# Altium schematic sheet Schematic-Indheater (Altium).schdoc
size 252 x 108 mm
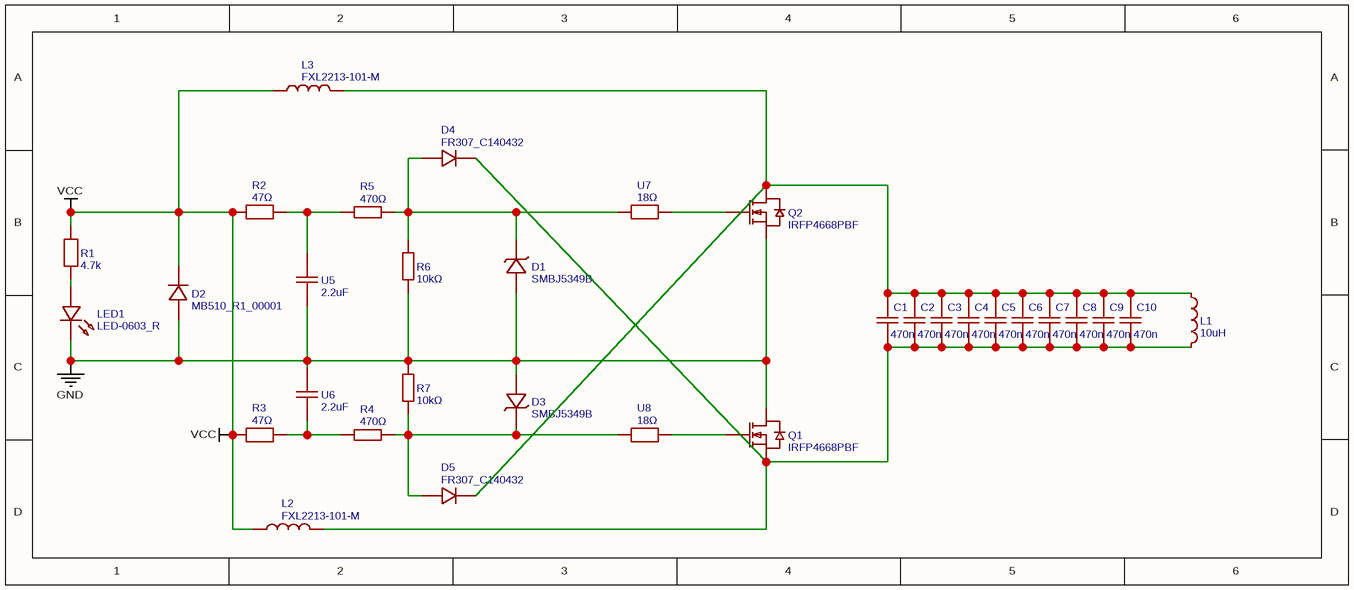
[diagram p0: Schematic-Indheater (Altium).schdoc]

## Parts
C1  470n  [CAP-TH_L17.8-W9.2-P15.00-D0.8]
C2  470n  [CAP-TH_L17.8-W9.2-P15.00-D0.8]
C3  470n  [CAP-TH_L17.8-W9.2-P15.00-D0.8]
C4  470n  [CAP-TH_L17.8-W9.2-P15.00-D0.8]
C5  470n  [CAP-TH_L17.8-W9.2-P15.00-D0.8]
C6  470n  [CAP-TH_L17.8-W9.2-P15.00-D0.8]
C7  470n  [CAP-TH_L17.8-W9.2-P15.00-D0.8]
C8  470n  [CAP-TH_L17.8-W9.2-P15.00-D0.8]
C9  470n  [CAP-TH_L17.8-W9.2-P15.00-D0.8]
C10  470n  [CAP-TH_L17.8-W9.2-P15.00-D0.8]
D1  SMBJ5349B  [SMB_L4.3-W3.6-LS5.2-RD]
D2  MB510_R1_00001  [SMC_L6.9-W5.9-LS7.9-RD]
D3  SMBJ5349B  [SMB_L4.3-W3.6-LS5.2-RD]
D4  FR307_C140432  [DO-201AD_BD5.3-L8.4-P12.50-D1.4-FD]
D5  FR307_C140432  [DO-201AD_BD5.3-L8.4-P12.50-D1.4-FD]
L1  10uH  [L0603]
L2  FXL2213-101-M  [FXL2213-101-M]
L3  FXL2213-101-M  [FXL2213-101-M]
LED1  LED-0603_R  [LED0603_RED]
Q1  IRFP4668PBF  [TO-247AC-3_L15.8-W5.0-P5.46-L]
Q2  IRFP4668PBF  [TO-247AC-3_L15.8-W5.0-P5.46-L]
R1  4.7k  [R0603]
R2  47Ω  [RES-SMD_L11.0-W5.0]
R3  47Ω  [RES-SMD_L11.0-W5.0]
R4  470Ω  [RES-TH_L13.0-W9.5-P4.50-D1.0]
R5  470Ω  [RES-TH_L13.0-W9.5-P4.50-D1.0]
R6  10kΩ  [RES-TH_BD3.3-L9.0-P13.00-D0.6]
R7  10kΩ  [RES-TH_BD3.3-L9.0-P13.00-D0.6]
U5  2.2uF  [C1206]
U6  2.2uF  [C1206]
U7  18Ω  [R0805]
U8  18Ω  [R0805]

## Nets
GND: D1.2(A) D2.2(A) D3.2(A) LED1.2 Q1.2(D) Q2.3(S) R6.1 R7.2 U5.1 U6.2
VCC: D2.1(K) L2.1 L3.1 R1.2 R2.1 R3.1
NetC1_1: C1.1 C2.1 C3.1 C4.1 C5.1 C6.1 C7.1 C8.1 C9.1 C10.1 D4.2 L1.2 L2.2 Q1.3(S)
NetC1_2: C1.2 C2.2 C3.2 C4.2 C5.2 C6.2 C7.2 C8.2 C9.2 C10.2 D5.2 L1.1 L3.2 Q2.2(D)
NetD1_1: D1.1(C) D4.1 R5.2 R6.2 U7.1
NetD3_1: D3.1(C) D5.1 R4.2 R7.1 U8.1
NetLED1_1: LED1.1 R1.1
NetQ1_1: Q1.1(G) U8.2
NetQ2_1: Q2.1(G) U7.2
NetR2_2: R2.2 R5.1 U5.2
NetR3_2: R3.2 R4.1 U6.1

## Library data of the parts
C1-C10 = 470n: Manufacturer: faratronic(厦门法拉); Manufacturer Part: C222J474K60C000; Contributor: LCSC; nameAlias: Value; Supplier: LCSC; Supplier Part: C783707; JLCPCB Part Class: Extended Part; spicePre: U; spiceSymbolName: C222J474K60C000
D1 D3 = SMBJ5349B: Manufacturer: LGE(鲁光); Contributor: LCSC; Supplier: LCSC; Supplier Part: C713635; Manufacturer Part: SMBJ5349B; JLCPCB Part Class: Extended Part; spicePre: D; spiceSymbolName: SMBJ5349B
D2 = MB510_R1_00001: Manufacturer: PANJIT(强茂); Contributor: LCSC; Supplier: LCSC; Supplier Part: C391527; Manufacturer Part: MB510_R1_00001; JLCPCB Part Class: Extended Part; spicePre: D; spiceSymbolName: MB510_R1_00001
D4 D5 = FR307_C140432: Manufacturer: 星海; Manufacturer Part: FR307; Contributor: 立创EDA官方封装库; Supplier Part: C140432; Supplier: LCSC; JLCPCB Part Class: Extended Part; spicePre: D; spiceSymbolName: FR307_C140432
L1 = 10uH: nameAlias: Value(H); Contributor: LCEDA_Lib; spicePre: L; spiceSymbolName: L0603_US
L2 L3 = FXL2213-101-M: Manufacturer: cjiang; Contributor: mtech; Manufacturer Part: FXL2213-101-M; Supplier: LCSC; Supplier Part: C22378764; spicePre: L; spiceSymbolName: FXL2213-101-M
LED1 = LED-0603_R: Manufacturer: EVERLIGHT(台湾亿光); Manufacturer Part: 19-217/R6C-AL1M2VY/3T; Contributor: LCEDA_01; Supplier Part: C72044; Supplier: LCSC; spicePre: L; spiceSymbolName: LED-0603_R
Q1 Q2 = IRFP4668PBF: Manufacturer: Infineon(英飞凌); Supplier: LCSC; Manufacturer Part: IRFP4668PBF; Supplier Part: C2921; JLCPCB Part Class: Extended Part; spicePre: Q; spiceSymbolName: IRFP4668PBF
R1 = 4.7k: nameAlias: Value(Ω); Contributor: LCEDA_Lib; spicePre: R; spiceSymbolName: R_0603_EU
R2 R3 = 47Ω: Manufacturer: TE Connectivity(泰科电子); Manufacturer Part: 355047RJT; nameAlias: Value; Contributor: lcsc; Supplier: LCSC; Supplier Part: C2095565; JLCPCB Part Class: Extended Part; spicePre: U; spiceSymbolName: 355047RJT
R4 R5 = 470Ω: Manufacturer: CCO(千志电子); Manufacturer Part: CR-M5W470Ω 5% P; nameAlias: Value; Contributor: LCSC; Supplier: LCSC; Supplier Part: C216421; JLCPCB Part Class: Extended Part; spicePre: R; spiceSymbolName: CR-M5W470ΩJ
R6 R7 = 10kΩ: Manufacturer: CCO(千志电子); Manufacturer Part: CF1/2W-10KΩ±5% T; nameAlias: Value; Contributor: LCSC; Supplier: LCSC; Supplier Part: C120262; JLCPCB Part Class: Extended Part; spicePre: R; spiceSymbolName: CF1/2W-10KΩ±5% T52
U5 U6 = 2.2uF: Manufacturer: CCTC(三环); Manufacturer Part: TCC1206X7R225K101HT; nameAlias: Value; Contributor: lcsc; Supplier: LCSC; Supplier Part: C7393990; JLCPCB Part Class: Extended Part; spicePre: U; spiceSymbolName: TCC1206X7R225K101HT
U7 U8 = 18Ω: Manufacturer: FOJAN(富捷); Manufacturer Part: FRC0805F18R0TS; nameAlias: Value; Contributor: lcsc; Supplier: LCSC; Supplier Part: C2930174; JLCPCB Part Class: Extended Part; spicePre: U; spiceSymbolName: FRC0805F18R0TS